# Altium schematic sheet Top.SchDoc
size B; SheetNumber: 1; SheetTotal: 8
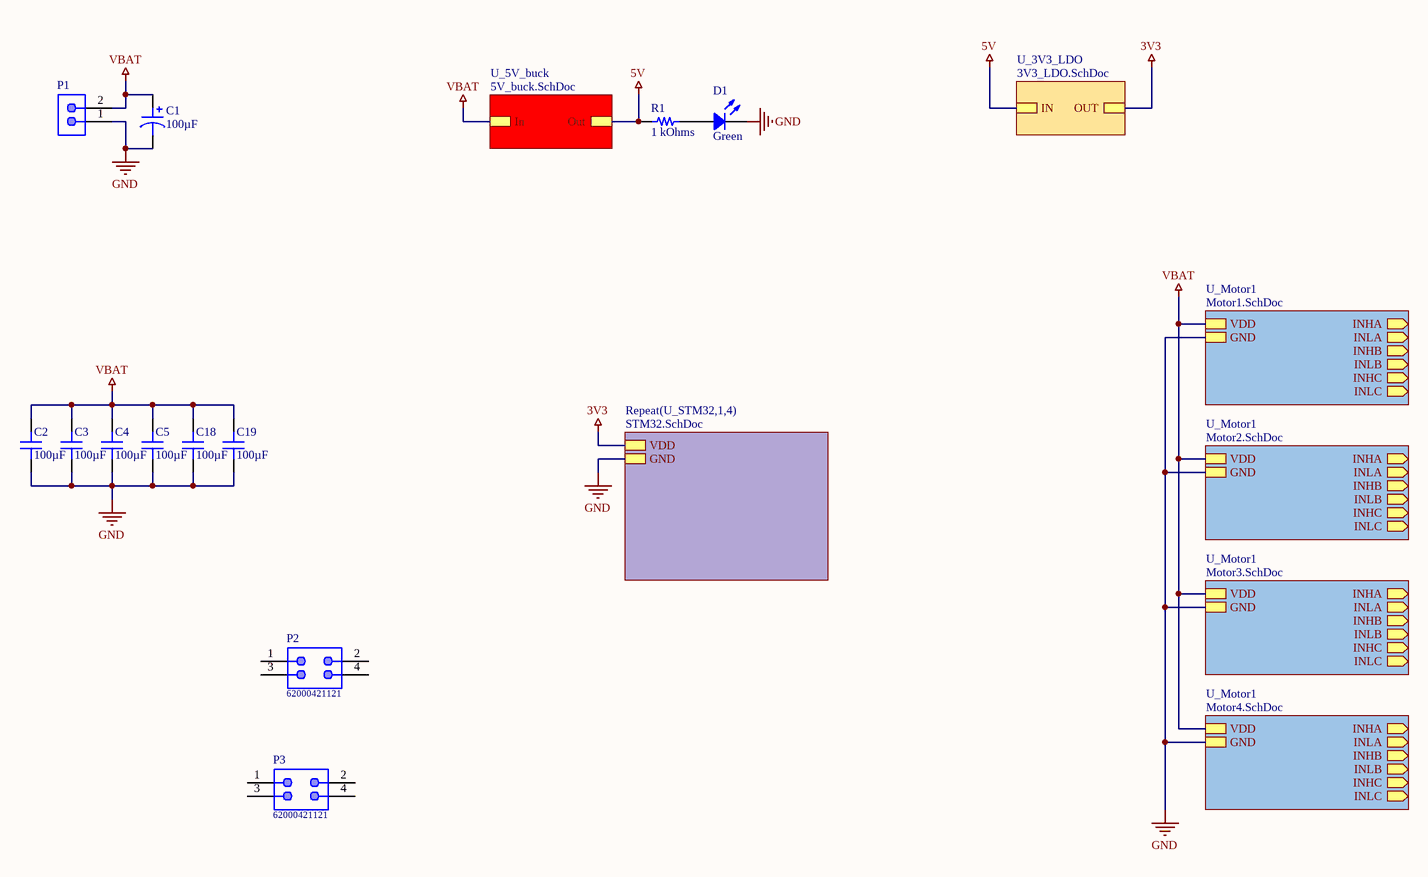
[diagram p0: Top.SchDoc]

## Parts
C1  100µF  [CAP POL 2917_7343]
C2  100µF  [CAP 1210_3225 - 2.8MM]
C3  100µF  [CAP 1210_3225 - 2.8MM]
C4  100µF  [CAP 1210_3225 - 2.8MM]
C5  100µF  [CAP 1210_3225 - 2.8MM]
C18  100µF  [CAP 1210_3225 - 2.8MM]
C19  100µF  [CAP 1210_3225 - 2.8MM]
D1  Green  [LED 0603_1608 GREEN]
P1  2 pin 2mm JST Male  [2pin - 2mm JST male]  (value not drawn)
P2  62000421121  [62000421121]
P3  62000421121  [62000421121]
R1  1 kOhms  [RES 0603_1608]

## Sub-sheets
Repeat(U_STM32,1,4) = STM32.SchDoc: VDD, GND
U_3V3_LDO = 3V3_LDO.SchDoc: OUT, IN
U_5V_buck = 5V_buck.SchDoc: Out, In
U_Motor1 = Motor1.SchDoc: VDD, GND, INHA (out), INLA (out), INHB (out), INLB (out), INHC (out), INLC (out)
U_Motor1 = Motor2.SchDoc: VDD, GND, INHA (out), INLA (out), INHB (out), INLB (out), INHC (out), INLC (out)
U_Motor1 = Motor3.SchDoc: VDD, GND, INHA (out), INLA (out), INHB (out), INLB (out), INHC (out), INLC (out)
U_Motor1 = Motor4.SchDoc: VDD, GND, INHA (out), INLA (out), INHB (out), INLB (out), INHC (out), INLC (out)

## Nets
3V3: sheet U_3V3_LDO/OUT, sheet Repeat(U_STM32,1,4)/VDD
5V: R1.1 ; sheet U_5V_buck/Out, sheet U_3V3_LDO/IN
GND: C1.2 C2.1 C3.1 C4.1 C5.1 C18.1 C19.1 D1.2 P1.1 ; sheet U_Motor1/GND, sheet U_Motor1/GND, sheet U_Motor1/GND, sheet U_Motor1/GND, sheet Repeat(U_STM32,1,4)/GND
VBAT: C1.1 C2.2 C3.2 C4.2 C5.2 C18.2 C19.2 P1.2 ; sheet U_5V_buck/In, sheet U_Motor1/VDD, sheet U_Motor1/VDD, sheet U_Motor1/VDD, sheet U_Motor1/VDD
NetD1_1: D1.1 R1.2

Not connected (* = marked no-connect by the designer): P2 1 2 3 4; P3 1 2 3 4

## Library data of the parts
C1 = 293D107X0020E2TE3: CAP TANT 100UF 20% 20V 2917; Manufacturer: Vishay Sprague; Manufacturer Size Code: E; ESR (Equivalent Series Resistance): 500mOhm; Type: Molded; Part Number: 293D107X0020E2TE3; Value: 100µF; Capacitance: 100µF; ComponentLink1Description: Datasheet; ComponentLink1URL: http://www.vishay.com/docs/40002/293d.pdf; ComponentLink2Description: DigiKey Link; ComponentLink2URL: http://digikey.com/product-detail/en/vishay-sprague/293D107X0020E2TE3/718-293D107X0020E2TE3CT-ND/10507022; Device Package: 2917 (7343 Metric); Features: General Purpose; Height - Seated (Max): 0.170" (4.32mm); LastUpdated: 13-Aug-20 10:43:35 AM; Lifecycle Status: Active; Minimum Order: 1; Mounting Type: Surface Mount; Operating Temperature: -55°C ~ 125°C; Package / Case: 2917 (7343 Metric); Packaging: TapeAndReel; PartId: 1360; Part Status: Active; Price: 0.70; Series: TANTAMOUNT®, 293D; Size / Dimension: 0.287" L x 0.169" W (7.30mm x 4.30mm); Supplier 1: DigiKey; Supplier Part Number 1: 718-293D107X0020E2TE3CT-ND; Tolerance: ±20%
C2-C5 C18 C19 = 12106D107MAT4A: CAP CER 100UF 6.3V X5R 1210; manufacturer: AVX Corporation; Tolerance: ±20%; Part Number: 12106D107MAT4A; Value: 100µF; Applications: General Purpose; Capacitance: 100µF; componentlink1description: Datasheet; componentlink1url: http://datasheets.avx.com/cx5r.pdf; componentlink2description: DigiKey Link; componentlink2url: http://digikey.com/product-detail/en/avx-corporation/12106D107MAT4A/478-11528-1-ND/8107729; Device Package: 1210 (3225 Metric); lastupdated: 9/2/2020 1:10:51 AM; Lifecycle Status: Active; Minimum Order: 1; Mounting Type: Surface Mount, MLCC; Operating Temperature: -55°C ~ 85°C; Package / Case: 1210 (3225 Metric); packaging: TapeAndReel; partid: 23954; Part Status: Active; price: 0.33; series: -; Size / Dimension: 0.126" L x 0.098" W (3.20mm x 2.50mm); Supplier 1: DigiKey; Supplier Part Number 1: 478-11528-1-ND; Temperature Coefficient: X5R; Thickness (Max): 0.110" (2.79mm); Voltage - Rated: 6.3V
D1 = XZCDGK53W-8VF: 1.6X0.8MM LC GREEN PIXSOLED DOME; Manufacturer: SunLED; Configuration: Independent; Current - Test: 2mA; Lens Color: Colorless; Lens Size: 0.35mm Dia; Lens Style: Round with Domed Top; Lens Transparency: Clear; Millicandela Rating: 417mcd; Viewing Angle: 60°; Voltage - Forward (Vf) (Typ): 2.65V; Wavelength - Dominant: 525nm; Wavelength - Peak: 515nm; Part Number: XZCDGK53W-8VF; Color: Green; ComponentLink1Description: Datasheet; ComponentLink1URL: https://www.sunledusa.com/products/spec/XZCDGK53W-8VF.pdf; ComponentLink2Description: DigiKey Link; ComponentLink2URL: http://digikey.com/product-detail/en/sunled/XZCDGK53W-8VF/1497-XZCDGK53W-8VFCT-ND/10449792; Device Package: 0603 (1608 Metric); Height (Max): 1.10mm; LastUpdated: 21-Jan-20 3:12:09 AM; Lifecycle Status: Active; Minimum Order: 1; Mounting Type: Surface Mount; Package / Case: 0603 (1608 Metric); Packaging: Unknown; PartId: 938; Part Status: Active; Price: 0.18; Series: Ultra Low Current; Size / Dimension: 1.60mm L x 0.80mm W; Supplier 1: DigiKey; Supplier Part Number 1: 1497-XZCDGK53W-8VFCT-ND; Supplier Device Package: 2-SMD; Value: Green
P2 P3 = 62000421121: WR-PHD Pin Header, THT, pitch 2mm, Dual Row, Vertical, 4p; Manufacturer: Wurth Elektronik; Pin Number: 4; Rated Current: 2A; Working Voltage: 200VAC; Withstanding Voltage: 500VAC; Contact Resistance: 20mOhm; ComponentLink1Description: Manufacturer; ComponentLink1URL: http://www.we-online.de; ComponentLink2Description: Datasheet; ComponentLink2URL: https://www.we-online.com/catalog/datasheet/62000421121.pdf; Operating Temperature: -40 to +105degC; Published Date: May 2020; Pitch: 2mm; Manufacturer Part Number: 62000421121; Mounting Technology: THT; Packaging: Bag; Gender: Pin Header; Row Number: Dual; Orientation: Vertical
R1 = RNCF0603DTE1K00: RES 1K OHM 0.5% 1/10W 0603; Manufacturer: Stackpole Electronics Inc; Power (Watts): 0.1W, 1/10W; Temperature Coefficient: ±25ppm/°C; Part Number: RNCF0603DTE1K00; Value: 1 kOhms; ComponentLink1Description: Datasheet; ComponentLink1URL: https://www.seielect.com/catalog/sei-rncf.pdf; ComponentLink2Description: DigiKey Link; ComponentLink2URL: http://digikey.com/product-detail/en/stackpole-electronics-inc/RNCF0603DTE1K00/RNCF0603DTE1K00CT-ND/9915086; Composition: Thin Film; Device Package: 0603 (1608 Metric); Features: Automotive AEC-Q200; Height - Seated (Max): 0.022" (0.55mm); LastUpdated: 21-Jan-20 12:14:28 AM; Lifecycle Status: Active; Minimum Order: 1; Number of Terminations: 2; Operating Temperature: -55°C ~ 155°C; Package / Case: 0603 (1608 Metric); Packaging: TapeAndReel; PartId: 26300; Part Status: Active; Price: 0.05; Ratings: AEC-Q200; Resistance: 1 kOhms; Series: RNCF; Size / Dimension: 0.061" L x 0.031" W (1.55mm x 0.80mm); Supplier 1: DigiKey; Supplier Part Number 1: RNCF0603DTE1K00CT-ND; Supplier Device Package: 0603; Tolerance: ±0.5%